# EAGLE schematic fractus_antenna (EAGLE 7.7.0)
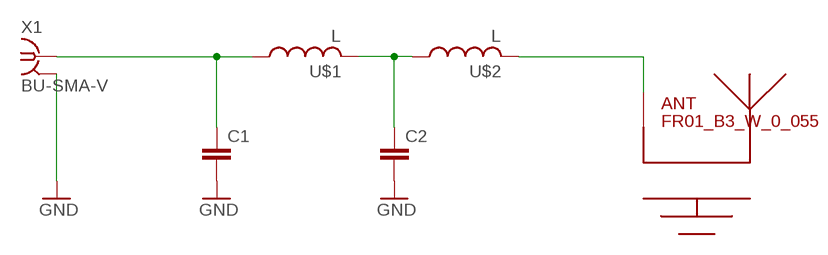
[diagram p0: schematic, sheet 1]

## Parts
ANT  FR01_B3_W_0_055  [FR01_B3_W_0_055]
C1  CC0603  [C0603]
C2  CC0603  [C0603]
U$1  L  [COILCRAFT_0805HP]
U$2  L  [COILCRAFT_0805HP]
X1  BU-SMA-V  [BU-SMA-V]

## Nets
GND: C1.2 C2.2 X1.2 X1.3 X1.4 X1.5
N$1: C1.1 U$1.1 X1.1
N$2: C2.1 U$1.2 U$2.1
N$4: ANT.FEED U$2.2
Unconnected: ANT.MOUNT0 ANT.MOUNT1 ANT.MOUNT2

## Library data of the parts
ANT = FM_transmitter:FR01_B3_W_0_055
C1 C2 = eagle-ltspice:C: CAPACITOR, European symbol; SPICEMODEL: NONE; SPICEPREFIX: C
U$1 U$2 = FM_transmitter:L
X1 = con-coax:BU-SMA-V: FEMALE SMA CONNECTOR Radiall distributor RS 112-3794; OC_FARNELL: unknown; OC_NEWARK: unknown